# EAGLE schematic Logic (EAGLE 7.1.0)
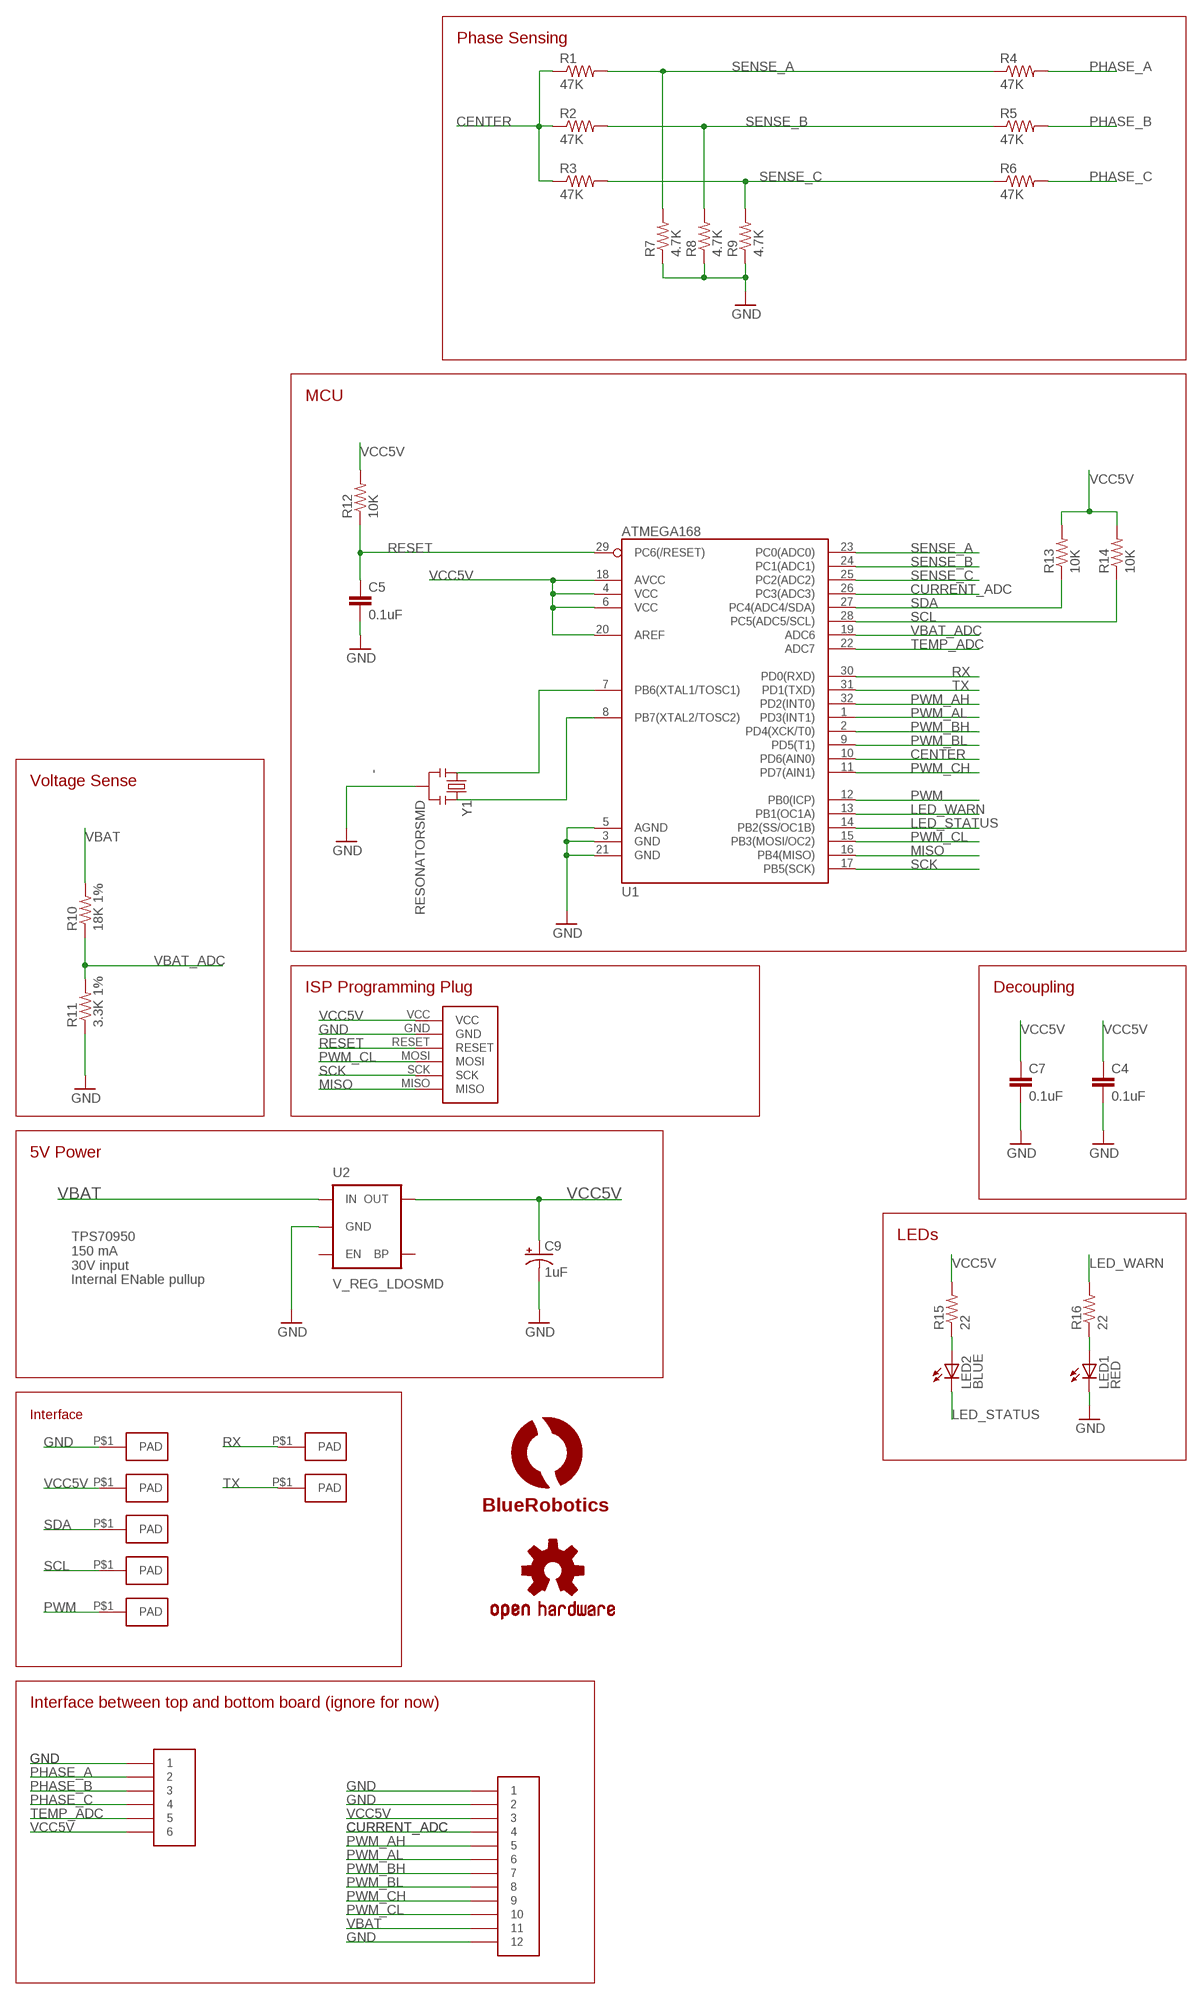
[diagram p0: schematic, sheet 1]

## Parts
C4  0.1uF  CAP0603-CAP  [0603-CAP]
C5  0.1uF  CAP0603-CAP  [0603-CAP]
C7  0.1uF  CAP0603-CAP  [0603-CAP]
C9  1uF  CAP_POL1206  [EIA3216]
LED1  RED  LED-3MM-NO_SILK  [LED3MM-NS]
LED2  BLUE  LED-3MM-NO_SILK  [LED3MM-NS]
LOGO1  OSHW-LOGOS  [OSHW-LOGO-S]
R1  47K  33KOHM1/10W1%(0603)  [0603-RES]
R2  47K  33KOHM1/10W1%(0603)  [0603-RES]
R3  47K  33KOHM1/10W1%(0603)  [0603-RES]
R4  47K  33KOHM1/10W1%(0603)  [0603-RES]
R5  47K  33KOHM1/10W1%(0603)  [0603-RES]
R6  47K  33KOHM1/10W1%(0603)  [0603-RES]
R7  4.7K  RESISTOR0603  [0603-RES]
R8  4.7K  RESISTOR0603  [0603-RES]
R9  4.7K  RESISTOR0603  [0603-RES]
R10  18K 1%  33KOHM1/10W1%(0603)  [0603-RES]
R11  3.3K 1%  33KOHM1/10W1%(0603)  [0603-RES]
R12  10K  33KOHM1/10W1%(0603)  [0603-RES]
R13  10K  33KOHM1/10W1%(0603)  [0603-RES]
R14  10K  33KOHM1/10W1%(0603)  [0603-RES]
R15  22  RESISTOR0603-RES  [0603-RES]
R16  22  RESISTOR0603-RES  [0603-RES]
U1  ATMEGA168  [TQFP32-08]
U2  V_REG_LDOSMD  [SOT23-5]
U$3  PAD1.5X3MM  [PAD-1.5X3MM]
U$4  LOGOBR-LOGO-S  [BR-LOGO-SMALL]
U$8  PAD1.5X3MM  [PAD-1.5X3MM]
U$9  PAD1.5X3MM  [PAD-1.5X3MM]
U$10  PAD1.5X3MM  [PAD-1.5X3MM]
U$11  PAD1.5X3MM  [PAD-1.5X3MM]
U$12  PAD1.5X3MM  [PAD-1.5X3MM]
U$13  PAD1.5X3MM  [PAD-1.5X3MM]
U$14  AVR-ISPTINY-SMD  [AVR-ISP-TINY]
U$16  HEADER-62MM  [HEADER-2MM-6POS]
U$17  HEADER-122MM  [HEADER-2MM-12POS]
Y1  RESONATORSMD  [RESONATOR-SMD]

## Nets
CENTER: R1.1 R2.1 R3.1 U1.10(PD6(AIN0))
CURRENT_ADC: U1.26(PC3(ADC3)) U$17.P$4
GND: C4.2 C5.2 C7.2 C9.C(-) LED1.K(C) R7.1 R8.1 R9.1 R11.1 U1.3(GND) U1.5(AGND) U1.21(GND) U2.2(GND) U$3.P$1(PAD) U$14.GND U$16.P$1 U$17.P$1 U$17.P$2 U$17.P$12 Y1.2
LED_STATUS: LED2.K(C) U1.14(PB2(SS/OC1B))
LED_WARN: R16.2 U1.13(PB1(OC1A))
MISO: U1.16(PB4(MISO)) U$14.MISO
N$3: LED1.A R16.1
N$10: U1.7(PB6(XTAL1/TOSC1)) Y1.1
N$11: U1.8(PB7(XTAL2/TOSC2)) Y1.3
N$16: LED2.A R15.1
PHASE_A: R4.2 U$16.P$2
PHASE_B: R5.2 U$16.P$3
PHASE_C: R6.2 U$16.P$4
PWM: U1.12(PB0(ICP)) U$11.P$1(PAD)
PWM_AH: U1.32(PD2(INT0)) U$17.P$5
PWM_AL: U1.1(PD3(INT1)) U$17.P$6
PWM_BH: U1.2(PD4(XCK/T0)) U$17.P$7
PWM_BL: U1.9(PD5(T1)) U$17.P$8
PWM_CH: U1.11(PD7(AIN1)) U$17.P$9
PWM_CL: U1.15(PB3(MOSI/OC2)) U$14.MOSI U$17.P$10
RESET: C5.1 R12.1 U1.29(PC6(/RESET)) U$14.RESET
RX: U1.30(PD0(RXD)) U$12.P$1(PAD)
SCK: U1.17(PB5(SCK)) U$14.SCK
SCL: R14.1 U1.28(PC5(ADC5/SCL)) U$10.P$1(PAD)
SDA: R13.1 U1.27(PC4(ADC4/SDA)) U$9.P$1(PAD)
SENSE_A: R1.2 R4.1 R7.2 U1.23(PC0(ADC0))
SENSE_B: R2.2 R5.1 R8.2 U1.24(PC1(ADC1))
SENSE_C: R3.2 R6.1 R9.2 U1.25(PC2(ADC2))
TEMP_ADC: U1.22(ADC7) U$16.P$5
TX: U1.31(PD1(TXD)) U$13.P$1(PAD)
VBAT: R10.2 U2.1(IN) U$17.P$11
VBAT_ADC: R10.1 R11.2 U1.19(ADC6)
VCC5V: C4.1 C7.1 C9.A(+) R12.2 R13.2 R14.2 R15.2 U1.4(VCC) U1.6(VCC) U1.18(AVCC) U1.20(AREF) U2.5(OUT) U$8.P$1(PAD) U$14.VCC U$16.P$6 U$17.P$3
Unconnected: U2.3(EN) U2.4(BP)

## Notes on the sheet
- Phase Sensing
- MCU
- Voltage Sense
- ISP Programming Plug | Decoupling
- 5V Power
- LEDs
- TPS70950
  150 mA
  30V input
  Internal ENable pullup
- Interface
- Interface between top and bottom board (ignore for now)

## Library data of the parts
C4 C5 C7 = SparkFun-Capacitors:CAP: Capacitor Standard 0603 ceramic capacitor, and 0.1" leaded capacitor.
C9 = SparkFun-Capacitors:CAP_POL: Capacitor Polarized These are standard SMD and PTH capacitors. Normally 10uF, 47uF, and 100uF in electrolytic and tantalum varieties. Always verify the external diameter of the through hole cap, it varies with capacity, voltage, and manufacturer. The EIA devices should be standard.
LED1 LED2 = SparkFun:LED: LEDs Standard schematic elements and footprints for 5mm, 3mm, 1206, and 0603 sized LEDs. 5mm - Spark Fun Electronics SKU : COM-00529 (and others)
LOGO1 = SparkFun-Aesthetics:OSHW-LOGO: Open Source Hardware Logo This logo indicates the piece of hardware it is found on incorporates a OSHW license and/or adheres to the definition of open source hardware found here: http://freedomdefined.org/OSHW
R1-R6 R10-R14 = SparkFun-Resistors:33KOHM1/10W1%(0603): RES-08416
R7-R9 = SparkFun-Resistors:RESISTOR: Resistor Basic schematic elements and footprints for 0603, 1206, and PTH resistors.
R15 R16 = SparkFun:RESISTOR: Resistor Basic schematic elements and footprints for 0603, 1206, and PTH resistors.
U1 = SparkFun-DigitalIC:ATMEGA168: Atmel 32-pin 8-bit micro, 16k flash.
U2 = SparkFun-PowerIC:V_REG_LDO: Voltage Regulator LDO Standard 150mA LDO voltage regulator in SOT-23 layout. Micrel part MIC5205. BP (by-pass) pin is used to lower output noise with 470pF cap.
U$3 U$8-U$13 = BR-Eagle-Library:PAD
U$4 = BR-Eagle-Library:LOGO
U$14 = BR-Eagle-Library:AVR-ISP
U$16 = BR-Eagle-Library:HEADER-6
U$17 = BR-Eagle-Library:HEADER-12
Y1 = SparkFun:RESONATOR: Resonator Small SMD resonator. This is the itty bitty 10/20MHz resonators with built in caps. CSTCE10M0G55 and CSTCE20M0V53. Footprint has been reviewed closely but hasn't been tested yet.